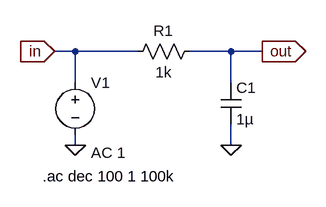
[diagram p0: schematic Frequncy_Response_LowPass.asc]
Frequncy_Response_LowPass.asc, the LTspice schematic file:
Version 4
SHEET 1 880 680
WIRE 48 48 16 48
WIRE 144 48 48 48
WIRE 288 48 224 48
WIRE 336 48 288 48
WIRE 48 96 48 48
WIRE 288 96 288 48
WIRE 48 192 48 176
WIRE 288 192 288 160
FLAG 288 192 0
FLAG 48 192 0
FLAG 336 48 out
IOPIN 336 48 Out
FLAG 16 48 in
IOPIN 16 48 In
SYMBOL voltage 48 80 R0
WINDOW 123 24 124 Left 2
WINDOW 39 0 0 Left 0
SYMATTR InstName V1
SYMATTR Value ""
SYMATTR Value2 AC 1
SYMBOL res 240 32 R90
WINDOW 0 0 56 VBottom 2
WINDOW 3 32 56 VTop 2
SYMATTR InstName R1
SYMATTR Value 1k
SYMBOL cap 272 96 R0
SYMATTR InstName C1
SYMATTR Value 1µ
TEXT -2 240 Left 2 !.ac dec 100 1 100k

The netlist it stands for:
* Frequncy_Response_LowPass.asc
V1 in 0 AC 1
R1 out in 1k
C1 out 0 1µ
.ac dec 100 1 100k
.backanno
.end